# Altium schematic sheet Top.SchDoc: MAX51
size A4; CompanyName: 北京一雄信息科技有限公司; DrawnBy: JIAWENWEI; Revision: 1.0; SheetNumber: 1; SheetTotal: 8
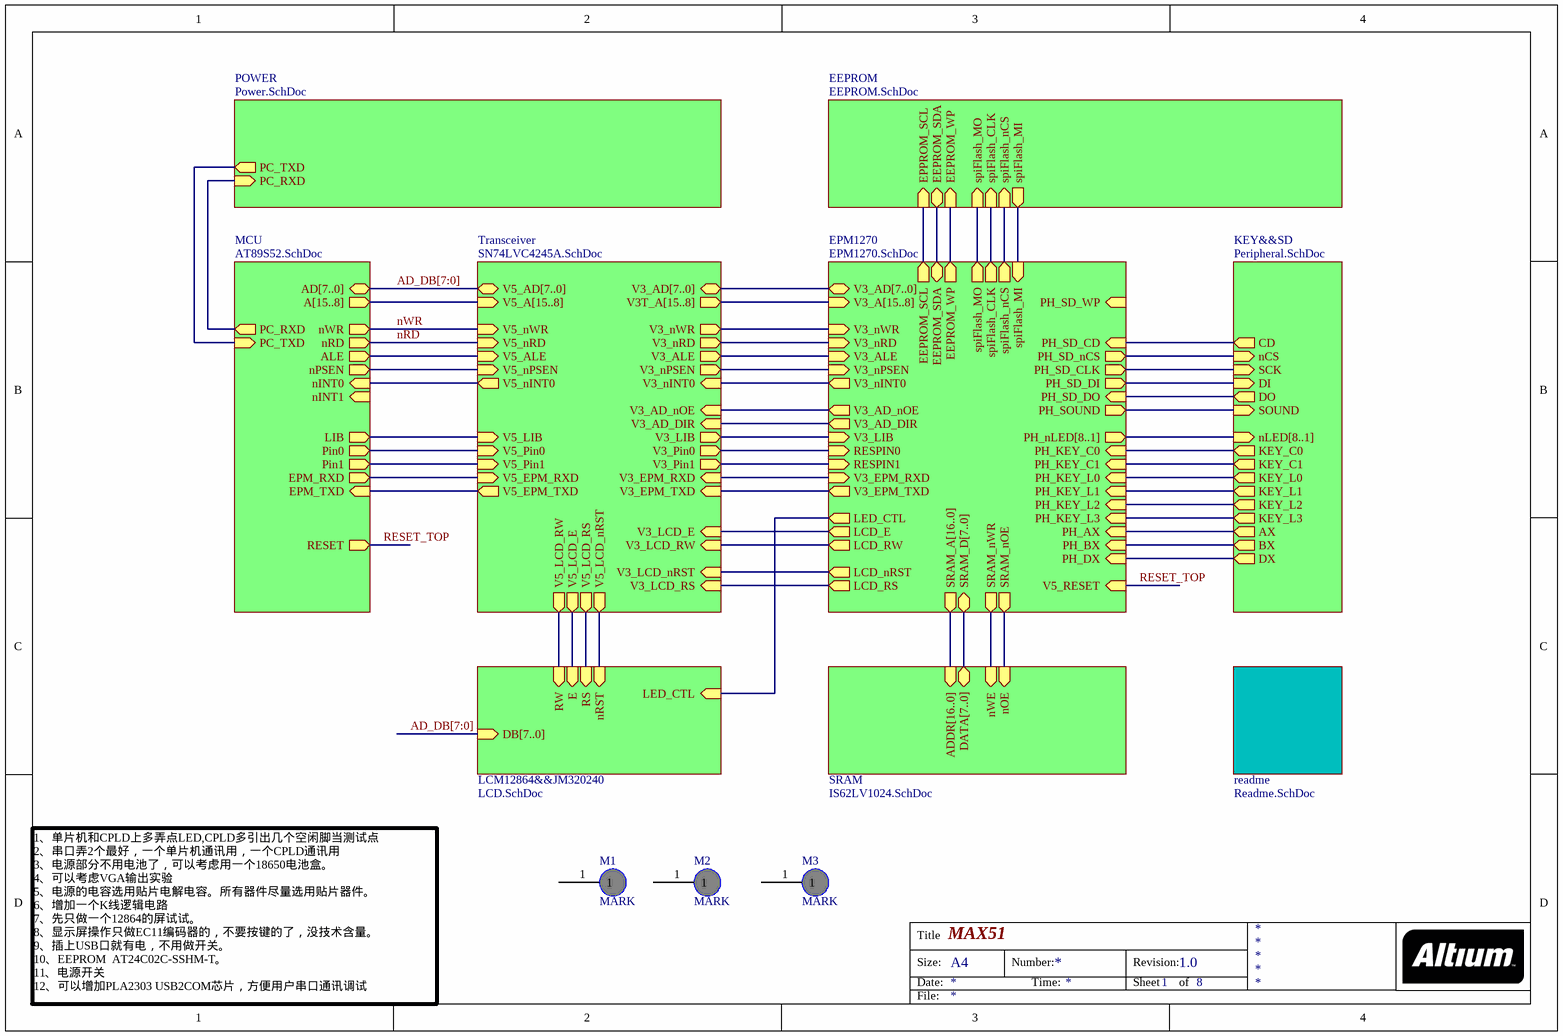
[diagram p0: Top.SchDoc]

## Parts
M1  MARK  [MARK3MM]
M2  MARK  [MARK3MM]
M3  MARK  [MARK3MM]

## Sub-sheets
EEPROM = EEPROM.SchDoc: EEPROM_SDA (bidir), EPPROM_SCL (in), EEPROM_WP (in), spiFlash_MO (in), spiFlash_CLK (in), spiFlash_nCS (in), spiFlash_MI (out)
EPM1270 = EPM1270.SchDoc: V3_LIB (in), V3_nPSEN (in), V3_nRD (in), V3_nWR (in), V3_ALE (in), V3_nINT0 (out), SRAM_nOE (out), SRAM_nWR (out), LCD_RS (out), LCD_nRST (out), LED_CTL (out), V3_AD_nOE (out), V3_AD_DIR (out), PH_SD_CD (in), PH_SD_WP (in), PH_SD_nCS (out), PH_SD_CLK (out), PH_SD_DI (out), PH_SD_DO (in), PH_SOUND (out), PH_KEY_C0 (in), PH_KEY_C1 (in), PH_KEY_L0 (in), PH_KEY_L1 (in), PH_KEY_L2 (in), PH_AX (in), PH_BX (in), PH_DX (in), V3_AD[7..0] (bidir), SRAM_A[16..0] (out), SRAM_D[7..0] (bidir), V3_A[15..8] (in), PH_nLED[8..1] (out), LCD_E (out), LCD_RW (out), V3_EPM_TXD (out), V3_EPM_RXD (in), RESPIN0 (in), RESPIN1 (in), V5_RESET (in), EEPROM_SDA (bidir), EEPROM_SCL (out), EEPROM_WP (out), spiFlash_MO (out), spiFlash_MI (in), spiFlash_CLK (out), spiFlash_nCS (out), PH_KEY_L3 (in)
KEY&&SD = Peripheral.SchDoc: KEY_C0 (out), KEY_C1 (out), KEY_L0 (out), KEY_L1 (out), KEY_L2 (out), SOUND (in), DI (in), SCK (in), DO (out), CD (out), AX (out), BX (out), DX (out), nCS (in), nLED[8..1] (in), KEY_L3 (out)
LCM12864&&JM320240 = LCD.SchDoc: RS (in), LED_CTL (in), nRST (in), DB[7..0] (in), RW (in), E (in)
MCU = AT89S52.SchDoc: nWR (out), nRD (out), ALE (out), nPSEN (out), nINT0 (in), LIB (out), AD[7..0] (bidir), A[15..8] (out), EPM_TXD (in), EPM_RXD (out), Pin0 (out), Pin1 (out), PC_RXD (out), PC_TXD (in), nINT1 (in), RESET (out)
POWER = Power.SchDoc: PC_TXD (out), PC_RXD (in)
readme = Readme.SchDoc: no entries
SRAM = IS62LV1024.SchDoc: nWE (in), nOE (in), ADDR[16..0] (in), DATA[7..0] (bidir)
Transceiver = SN74LVC4245A.SchDoc: V3_LCD_RS (in), V3_LCD_nRST (in), V5_LCD_RS (out), V5_LCD_nRST (out), V3_AD_DIR (in), V3_AD_nOE (in), V3_nINT0 (in), V5_LIB (in), V5_nPSEN (in), V5_nRD (in), V5_nWR (in), V5_ALE (in), V3_LIB (out), V3_nPSEN (out), V3_nRD (out), V3_nWR (out), V3_ALE (out), V5_nINT0 (out), V5_AD[7..0] (bidir), V3_AD[7..0] (bidir), V5_A[15..8] (in), V3T_A[15..8] (out), V3_LCD_RW (in), V3_LCD_E (in), V5_LCD_RW (out), V5_LCD_E (out), V5_Pin0 (in), V3_Pin0 (out), V5_EPM_TXD (out), V3_EPM_TXD (in), V3_Pin1 (out), V5_Pin1 (in), V5_EPM_RXD (in), V3_EPM_RXD (in)

## Nets
nRD: sheet MCU/nRD, sheet Transceiver/V5_nRD
nWR: sheet MCU/nWR, sheet Transceiver/V5_nWR
RESET_TOP: sheet MCU/RESET, sheet EPM1270/V5_RESET
(unnamed): sheet POWER/PC_TXD, sheet MCU/PC_TXD
(unnamed): sheet POWER/PC_RXD, sheet MCU/PC_RXD
(unnamed): sheet MCU/ALE, sheet Transceiver/V5_ALE
(unnamed): sheet MCU/nPSEN, sheet Transceiver/V5_nPSEN
(unnamed): sheet MCU/nINT0, sheet Transceiver/V5_nINT0
(unnamed): sheet MCU/LIB, sheet Transceiver/V5_LIB
(unnamed): sheet MCU/EPM_TXD, sheet Transceiver/V5_EPM_TXD
(unnamed): sheet MCU/EPM_RXD, sheet Transceiver/V5_EPM_RXD
(unnamed): sheet MCU/Pin0, sheet Transceiver/V5_Pin0
(unnamed): sheet MCU/Pin1, sheet Transceiver/V5_Pin1
(unnamed): sheet EPM1270/V3_LIB, sheet Transceiver/V3_LIB
(unnamed): sheet EPM1270/V3_nPSEN, sheet Transceiver/V3_nPSEN
(unnamed): sheet EPM1270/V3_nRD, sheet Transceiver/V3_nRD
(unnamed): sheet EPM1270/V3_nWR, sheet Transceiver/V3_nWR
(unnamed): sheet EPM1270/V3_ALE, sheet Transceiver/V3_ALE
(unnamed): sheet EPM1270/V3_nINT0, sheet Transceiver/V3_nINT0
(unnamed): sheet EPM1270/SRAM_nOE, sheet SRAM/nOE
(unnamed): sheet EPM1270/SRAM_nWR, sheet SRAM/nWE
(unnamed): sheet EPM1270/LCD_RS, sheet Transceiver/V3_LCD_RS
(unnamed): sheet EPM1270/LCD_nRST, sheet Transceiver/V3_LCD_nRST
(unnamed): sheet EPM1270/LED_CTL, sheet LCM12864&&JM320240/LED_CTL
(unnamed): sheet EPM1270/V3_AD_nOE, sheet Transceiver/V3_AD_nOE
(unnamed): sheet EPM1270/V3_AD_DIR, sheet Transceiver/V3_AD_DIR
(unnamed): sheet EPM1270/PH_SD_CD, sheet KEY&&SD/CD
(unnamed): sheet EPM1270/PH_SD_nCS, sheet KEY&&SD/nCS
(unnamed): sheet EPM1270/PH_SD_CLK, sheet KEY&&SD/SCK
(unnamed): sheet EPM1270/PH_SD_DI, sheet KEY&&SD/DI
(unnamed): sheet EPM1270/PH_SD_DO, sheet KEY&&SD/DO
(unnamed): sheet EPM1270/PH_SOUND, sheet KEY&&SD/SOUND
(unnamed): sheet EPM1270/PH_KEY_C0, sheet KEY&&SD/KEY_C0
(unnamed): sheet EPM1270/PH_KEY_C1, sheet KEY&&SD/KEY_C1
(unnamed): sheet EPM1270/PH_KEY_L0, sheet KEY&&SD/KEY_L0
(unnamed): sheet EPM1270/PH_KEY_L1, sheet KEY&&SD/KEY_L1
(unnamed): sheet EPM1270/PH_KEY_L2, sheet KEY&&SD/KEY_L2
(unnamed): sheet EPM1270/PH_AX, sheet KEY&&SD/AX
(unnamed): sheet EPM1270/PH_BX, sheet KEY&&SD/BX
(unnamed): sheet EPM1270/PH_DX, sheet KEY&&SD/DX
(unnamed): sheet EPM1270/LCD_E, sheet Transceiver/V3_LCD_E
(unnamed): sheet EPM1270/LCD_RW, sheet Transceiver/V3_LCD_RW
(unnamed): sheet EPM1270/V3_EPM_TXD, sheet Transceiver/V3_EPM_TXD
(unnamed): sheet EPM1270/V3_EPM_RXD, sheet Transceiver/V3_EPM_RXD
(unnamed): sheet EPM1270/RESPIN0, sheet Transceiver/V3_Pin0
(unnamed): sheet EPM1270/RESPIN1, sheet Transceiver/V3_Pin1
(unnamed): sheet EPM1270/EEPROM_SDA, sheet EEPROM/EEPROM_SDA
(unnamed): sheet EPM1270/EEPROM_SCL, sheet EEPROM/EPPROM_SCL
(unnamed): sheet EPM1270/EEPROM_WP, sheet EEPROM/EEPROM_WP
(unnamed): sheet EPM1270/spiFlash_MO, sheet EEPROM/spiFlash_MO
(unnamed): sheet EPM1270/spiFlash_MI, sheet EEPROM/spiFlash_MI
(unnamed): sheet EPM1270/spiFlash_CLK, sheet EEPROM/spiFlash_CLK
(unnamed): sheet EPM1270/spiFlash_nCS, sheet EEPROM/spiFlash_nCS
(unnamed): sheet EPM1270/PH_KEY_L3, sheet KEY&&SD/KEY_L3
(unnamed): sheet LCM12864&&JM320240/RS, sheet Transceiver/V5_LCD_RS
(unnamed): sheet LCM12864&&JM320240/nRST, sheet Transceiver/V5_LCD_nRST
(unnamed): sheet LCM12864&&JM320240/RW, sheet Transceiver/V5_LCD_RW
(unnamed): sheet LCM12864&&JM320240/E, sheet Transceiver/V5_LCD_E

Not connected (* = marked no-connect by the designer): M1 1; M2 1; M3 1

## Buses and harness runs
bus AD_DB[7:0] = sheet LCM12864&&JM320240/DB[7..0]
bus AD_DB[7:0] = sheet MCU/AD[7..0] = sheet Transceiver/V5_AD[7..0]
bus sheet EPM1270/PH_nLED[8..1] = sheet KEY&&SD/nLED[8..1]
bus sheet EPM1270/SRAM_A[16..0] = sheet SRAM/ADDR[16..0]
bus sheet EPM1270/SRAM_D[7..0] = sheet SRAM/DATA[7..0]
bus sheet EPM1270/V3_A[15..8] = sheet Transceiver/V3T_A[15..8]
bus sheet EPM1270/V3_AD[7..0] = sheet Transceiver/V3_AD[7..0]
bus sheet MCU/A[15..8] = sheet Transceiver/V5_A[15..8]

## Notes on the sheet
- 1、单片机和CPLD上多弄点LED,CPLD多引出几个空闲脚当测试点
  2、串口弄2个最好，一个单片机通讯用，一个CPLD通讯用
  3、电源部分不用电池了，可以考虑用一个18650电池盒。
  4、可以考虑VGA输出实验
  5、电源的电容选用贴片电解电容。所有器件尽量选用贴片器件。
  6、增加一个K线逻辑电路
  7、先只做一个12864的屏试试。
  8、显示屏操作只做EC11编码器的，不要按键的了，没技术含量。
  9、插上USB口就有电，不用做开关。
  10、EEPROM  AT24C02C-SSHM-T。
  11、电源开关
  12、可以增加PLA2303 USB2COM芯片，方便用户串口通讯调试
- Title
- Size:
- Date:
- A4
- Number:
- Time:
- Revision:
- Sheet
- of
- File: